# EAGLE design led bar (EAGLE 8.2.2)
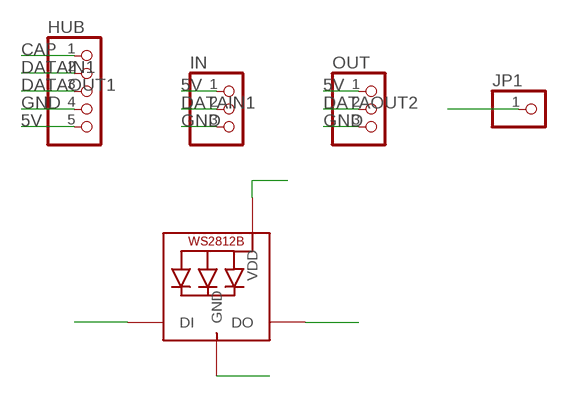
[diagram p0: schematic, sheet 1]

## Parts
HUB  PINHD-1X5  [1X05]
IN  PINHD-1X3  [1X03]
JP1  PINHD-1X1  [1X01]
LED1  WS2812B5050  [WS2812B]
OUT  PINHD-1X3  [1X03]

## Nets
5V: HUB.5 IN.1 LED1.1-VDD(VDD) OUT.1
CAP: HUB.1
DATAIN1: HUB.2 IN.2 LED1.4-DIN(DI)
DATAOUT1: HUB.3 JP1.1
DATAOUT2: LED1.2-DOUT(DO) OUT.2
GND: HUB.4 IN.3 LED1.3-GND(GND) OUT.3

## Library data of the parts
HUB = pinhead:PINHD-1X5: PIN HEADER
IN OUT = pinhead:PINHD-1X3: PIN HEADER
JP1 = pinhead:PINHD-1X1: PIN HEADER
LED1 = adafruit:WS2812B

## Board
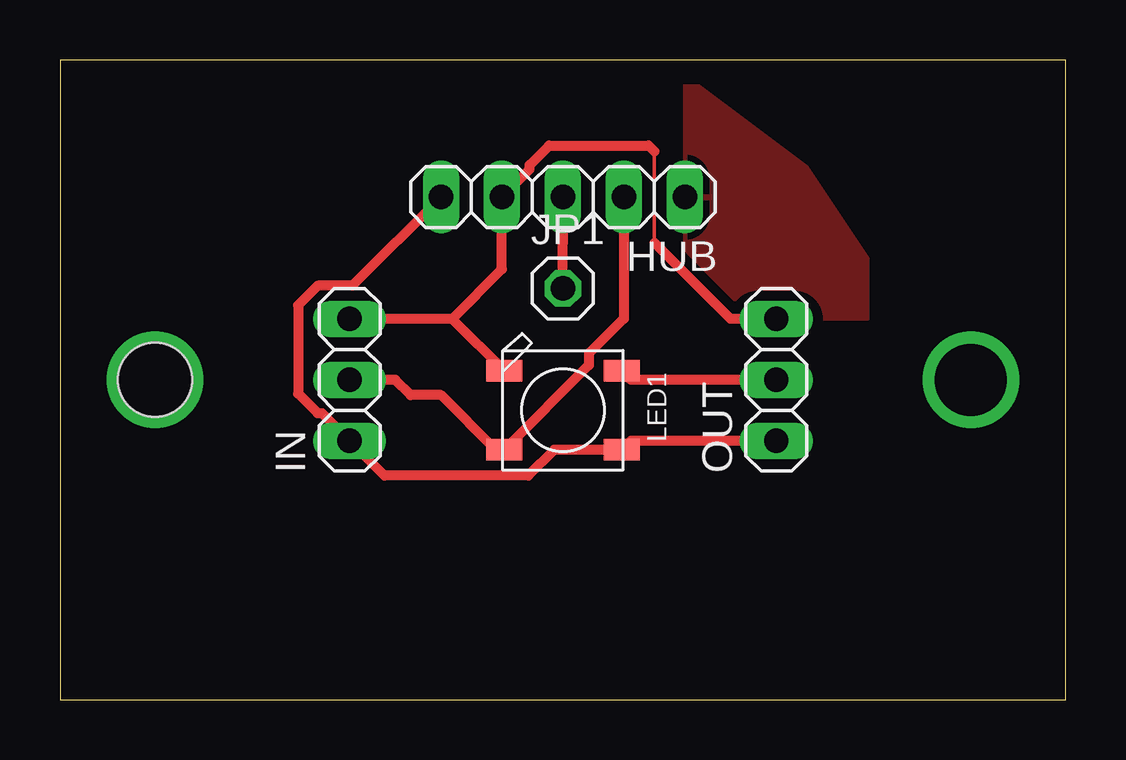
[diagram p1: board, top side]

Size 41.91 x 26.67 mm. Coordinates in mm from the lower left corner, seen from the top.
Outline: 0,0 41.91,0 41.91,26.67 0,26.66 0,0
Copper layers (1*16): Top 0.035mm / dielectric 1.5mm / Bottom 0.035mm
Design rules "fabmodule": minimum track width 10mil, minimum drill 0.4mm, track to track 0.42mm, track to pad 0.42mm, pad to pad 0.42mm, via to via 0.42mm, smd to smd 0.42mm, copper to edge 40mil, drill to drill 0.8mm, minimum pad ring 10mil, minimum via ring 8mil, stop-mask expansion 4mil, vias tented up to drill 0mil, thermal gap 10mil
Holes 3.1 mm at 3.96,13.33

### Footprints (pad centres in the part's own frame; a part is rotated, then mirrored left to right if it is on the bottom)
1X05 = drill 1.016 long: 1 -5.08,0; 2 -2.54,0; 3 0,0; 4 2.54,0; 5 5.08,0
1X03 = drill 1.016 long: 1 -2.54,0; 2 0,0; 3 2.54,0
1X01 = drill 1.016 octagon: 1 0,0
WS2812B = smd 1.5 x 0.9: 1-VDD 2.45,-1.65; 2-DOUT 2.45,1.65; 3-GND -2.45,1.65; 4-DIN -2.45,-1.65

### Placement (x,y rotation side)
HUB  20.96,20.96 180 top
IN  12.06,13.33 90 top
JP1  20.96,17.15 0 top
LED1  20.96,12.06 0 top
OUT  29.85,13.33 90 top

### Tracks (layer width: path | path; a pad name or v marks a point on that pad's centre or on a via)
5V
  Top 0.406: OUT.1 23.79,10.79 LED1.1-VDD 20.59,10.41 19.51,9.34 13.52,9.34 12.22,10.63 | 12.22,10.63 IN.1 | HUB.5 12.18,17.26 10.73,17.26 9.92,16.45 9.92,12.76 10.73,11.95 10.91,11.95 12.22,10.63
CAP
  pour Top: 26.04,20.96 26.04,15.88 33.66,15.88 33.66,18.42 31.12,22.23 26.04,26.04
DATAIN1
  Top 0.406: IN.2 13.97,13.33 14.61,12.7 15.88,12.7 18.16,10.41 LED1.4-DIN 22.03,13.94 22.03,14.42 23.5,15.89 HUB.2
DATAOUT1
  Top 0.406: 20.96,19.05 HUB.3 JP1.1
DATAOUT2
  Top 0.406: OUT.2 23.79,13.33 LED1.2-DOUT
GND
  Top 0.152: 24.77,22.86 24.77,19.05
  Top 0.406: 16.35,15.88 IN.3 | 16.35,15.88 LED1.3-GND | 16.35,15.88 18.42,17.95 HUB.4 19.57,22.11 19.57,22.29 20.38,23.1 24.52,23.1 24.77,22.86 | OUT.3 27.94,15.88 24.77,19.05
N$1  (via drill 3)
  other vias: 3.96,13.33
N$2  (via drill 3)
  other vias: 37.95,13.33